# Altium schematic sheet Ethernet.SchDoc
size A4
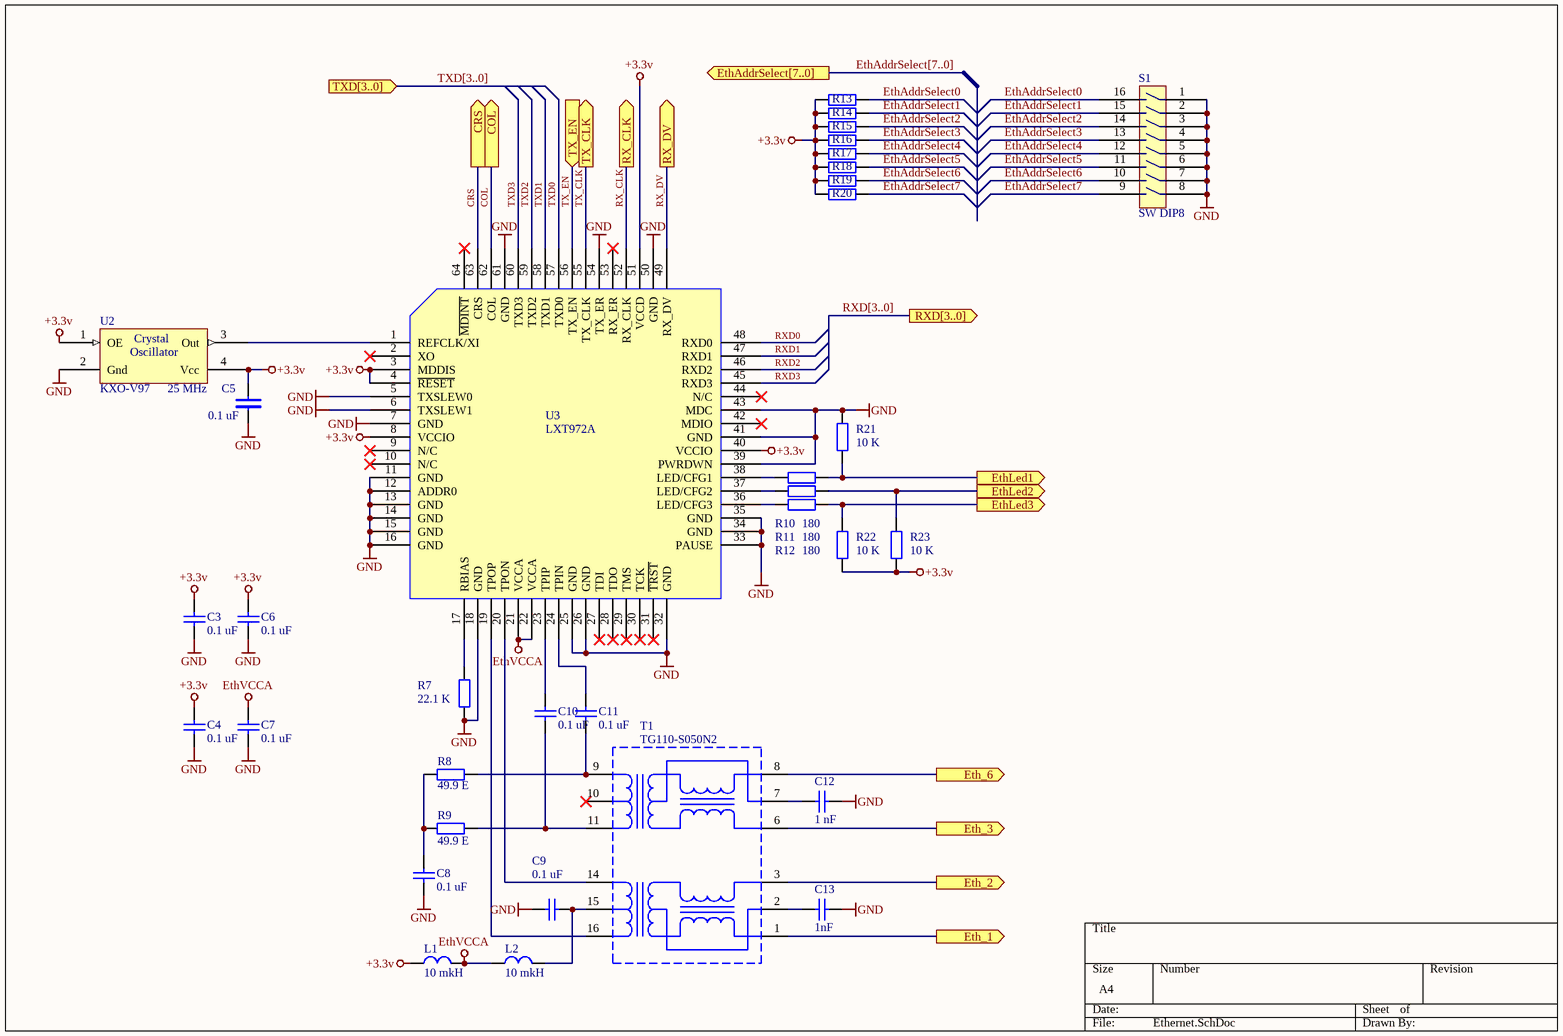
[diagram p0: Ethernet.SchDoc]

## Parts
C3  0.1 uF  [0603]
C4  0.1 uF  [0603]
C5  0.1 uF  [1206]
C6  0.1 uF  [0603]
C7  0.1 uF  [0603]
C8  0.1 uF  [0603]
C9  0.1 uF  [0603]
C10  0.1 uF  [0603]
C11  0.1 uF  [0603]
C12  1 nF  [1206]
C13  value 1nF  [1206]  (hidden comment: 1 nF)
L1  value 10 mkH  [0805]  (hidden comment: Inductor)
L2  value 10 mkH  [0805]  (hidden comment: Inductor)
R7  22.1 K  [0805]
R8  49.9 E  [0805]
R9  49.9 E  [0805]
R10  180  [0805]
R11  180  [0805]
R12  180  [0805]
R13  10 K  [0603]  (value not drawn)
R14  10 K  [0603]  (value not drawn)
R15  10 K  [0603]  (value not drawn)
R16  10 K  [0603]  (value not drawn)
R17  10 K  [0603]  (value not drawn)
R18  10 K  [0603]  (value not drawn)
R19  10 K  [0603]  (value not drawn)
R20  10 K  [0603]  (value not drawn)
R21  10 K  [0603]
R22  10 K  [0603]
R23  10 K  [0603]
S1  SW DIP8  [SWD1-8]
T1  TG110-S050N2  [SO-G16/G6.9]
U2  KXO-V97  [KXO-97]
U3  LXT972A  [TQFP64]

## Ports
COL (out), CRS (out), Eth_1 (out), Eth_2 (out), Eth_3 (out), Eth_6 (out), EthAddrSelect[7..0] (out), EthLed1 (out), EthLed2 (out), EthLed3 (out), RX_CLK (out), RX_DV (out), RXD[3..0] (out), TX_CLK (out), TX_EN (in), TXD[3..0] (in)

## Nets
+3.3v: C3.2 C4.2 C5.2 C6.2 L1.1 R13.2 R14.2 R15.2 R16.2 R17.2 R18.2 R19.2 R20.2 R22.1 R23.1 U2.1(OE) U2.4(Vcc) U3.3(MDDIS) U3.4(~{RESET}) U3.8(VCCIO) U3.40(VCCIO) U3.51(VCCD)
EthVCCA: C7.2 L1.2 L2.1 U3.21(VCCA) U3.22(VCCA)
GND: C3.1 C4.1 C5.1 C6.1 C7.1 C8.2 C9.1 C12.2 C13.1 R7.2 R21.2 S1.1 S1.2 S1.3 S1.4 S1.5 S1.6 S1.7 S1.8 U2.2(Gnd) U3.5(TXSLEW0) U3.6(TXSLEW1) U3.7(GND) U3.11(GND) U3.12(ADDR0) U3.13(GND) U3.14(GND) U3.15(GND) U3.16(GND) U3.18(GND) U3.25(GND) U3.26(GND) U3.32(GND) U3.33(PAUSE) U3.34(GND) U3.35(GND) U3.39(PWRDWN) U3.41(GND) U3.43(MDC) U3.50(GND) U3.54(TX_ER) U3.61(GND)
COL: U3.62(COL) ; port COL
CRS: U3.63(CRS) ; port CRS
Eth_1: T1.1 ; port Eth_1
Eth_2: T1.3 ; port Eth_2
Eth_3: T1.6 ; port Eth_3
Eth_6: T1.8 ; port Eth_6
EthAddrSelect0: R13.1 S1.16
EthAddrSelect1: R14.1 S1.15
EthAddrSelect2: R15.1 S1.14
EthAddrSelect3: R16.1 S1.13
EthAddrSelect4: R17.1 S1.12
EthAddrSelect5: R18.1 S1.11
EthAddrSelect6: R19.1 S1.10
EthAddrSelect7: R20.1 S1.9
EthLed1: R10.2 R21.1 ; port EthLed1
EthLed2: R11.2 R23.2 ; port EthLed2
EthLed3: R12.2 R22.2 ; port EthLed3
RX_CLK: U3.52(RX_CLK) ; port RX_CLK
RX_DV: U3.49(RX_DV) ; port RX_DV
RXD0: U3.48(RXD0)
RXD1: U3.47(RXD1)
RXD2: U3.46(RXD2)
RXD3: U3.45(RXD3)
TX_CLK: U3.55(TX_CLK) ; port TX_CLK
TX_EN: U3.56(TX_EN) ; port TX_EN
TXD0: U3.57(TXD0)
TXD1: U3.58(TXD1)
TXD2: U3.59(TXD2)
TXD3: U3.60(TXD3)
NetC8_1: C8.1 R8.1 R9.2
NetC9_2: C9.2 L2.2 T1.15
NetC10_1: C10.1 R9.1 T1.11
NetC10_2: C10.2 U3.23(TPIP)
NetC11_1: C11.1 R8.2 T1.9
NetC11_2: C11.2 U3.24(TPIN)
NetC12_1: C12.1 T1.7
NetC13_2: C13.2 T1.2
NetR7_1: R7.1 U3.17(RBIAS)
NetR10_1: R10.1 U3.38(LED/CFG1)
NetR11_1: R11.1 U3.37(LED/CFG2)
NetR12_1: R12.1 U3.36(LED/CFG3)
NetT1_14: T1.14 U3.20(TPON)
NetT1_16: T1.16 U3.19(TPOP)
NetU2_3: U2.3(Out) U3.1(REFCLK/XI)

Not connected (* = marked no-connect by the designer): T1 10*; U3 2(XO)* 9(N/C)* 10(N/C)* 27(TDI)* 28(TDO)* 29(TMS)* 30(TCK)* 31(~{TRST})* 42(MDIO)* 44(N/C)* 53(RX_ER)* 64(~{MDINT})*

## Buses and harness runs
bus EthAddrSelect[7..0] = port EthAddrSelect[7..0]
bus RXD[3..0] = port RXD[3..0]
bus TXD[3..0] = port TXD[3..0]

## Notes on the sheet
- (near U2) 25 MHz
- (in symbol SG-636) Crystal; Oscillator

## Library data of the parts
C3 C4 C6-C13 = Cap: Capacitor; Published: 8-Jun-2000; LatestRevisionDate: 17-Jul-2002; LatestRevisionNote: Re-released for DXP Platform.; Publisher: Altium Limited
  C3 C4 C6-C11: Value: 0.1 uF
  C12: Value: 1 nF
C5 = C
L1 L2 = Inductor: Code_IEC: 1005; Published: 8-Jun-2000; LatestRevisionDate: 17-Jul-2002; LatestRevisionNote: Re-released for DXP Platform.; PackageReference: 0402-A; Publisher: Altium Limited; Code_JEITA: 0402
R7-R23 = Res2: Resistor; Published: 8-Jun-2000; LatestRevisionDate: 17-Jul-2002; LatestRevisionNote: Re-released for DXP Platform.; Publisher: Altium Limited; PackageReference: AXIAL-0.4
  R7: Value: 22.1 K
  R8 R9: Value: 49.9 E
  R10-R12: Value: 180
  R13-R23: Value: 10 K
U2 = SG-636: Crystal Oscillator (SMD)